# Altium schematic sheet boxer_supply.SchDoc: Power and Supply (+5V)
size A4; DrawnBy: Damian Dolewski; Engineer: Damian Dolewski; DocumentNumber: 2; SheetNumber: 2; SheetTotal: 3
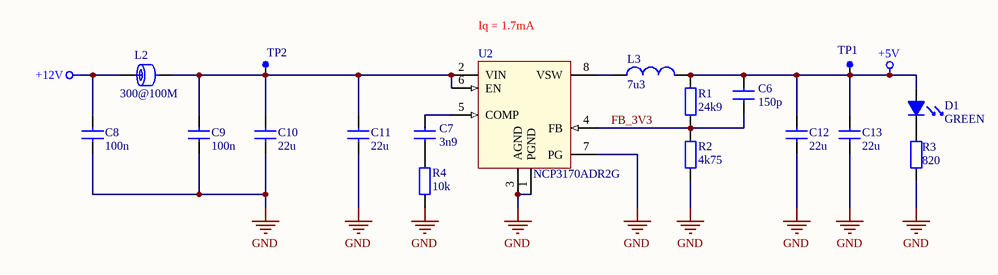
[diagram p0: boxer_supply.SchDoc]

## Parts
C6  value 150p  [C_0805]  (hidden comment: 885012207081)
C7  value 3n9  [C_0805]  (hidden comment: 885012207089)
C8  value 100n  [C_0805]  (hidden comment: Capacitor)
C9  value 100n  [C_0805]  (hidden comment: Capacitor)
C10  value 22u  [C_1206]  (hidden comment: TME: CL31A226MOCLNNC)
C11  value 22u  [C_1206]  (hidden comment: TME: CL31A226MOCLNNC)
C12  value 22u  [C_1206]  (hidden comment: TME: CL31A226MOCLNNC)
C13  value 22u  [C_1206]  (hidden comment: TME: CL31A226MOCLNNC)
D1  value GREEN  [LED_0805]  (hidden comment: KP-2012LSGC)
L2  value 300@100M  [L_0805]  (hidden comment: 742792031)
L3  value 7u3  [L_6.7x6.7mm]  (hidden comment: 308-1500-1-ND)
R1  value 24k9  [R_0805]  (hidden comment: RNCP0805FTD24K9)
R2  value 4k75  [R_0805]  (hidden comment: RNCP0805FTD4K75)
R3  value 820  [R_0805]  (hidden comment: Resistor)
R4  value 10k  [R_1206]  (hidden comment: Resistor)
TP1  TEST PAD  [PIN]  (value not drawn)
TP2  TEST PAD  [PIN]  (value not drawn)
U2  NCP3170ADR2G  [SO8]

## Nets
+5V: C6.2 C12.2 C13.2 D1.1(A) L3.2 R1.2 TP1.1
+12V: C8.2 L2.1
GND: C8.1 C9.1 C10.1 C11.1 C12.1 C13.1 R2.1 R3.1 R4.1 U2.1(PGND) U2.3(AGND) U2.7(PG)
FB_3V3: C6.1 R1.1 R2.2 U2.4(FB)
NetC7_1: C7.1 R4.2
NetC7_2: C7.2 U2.5(COMP)
NetC9_2: C9.2 C10.2 C11.2 L2.2 TP2.1 U2.2(VIN) U2.6(EN)
NetD1_2: D1.2(K) R3.2
NetL3_1: L3.1 U2.8(VSW)

## Notes on the sheet
- (near U2) Iq = 1.7mA
- Title:
- Size:
- A4
- Number:
- Revision:
- Date:
- File:
- Sheet
- of

## Library data of the parts
C6 C7 C10-C13 = Capacitor
D1 = LED: Typical RED, GREEN, YELLOW, AMBER GaAs LED
L2 = FB: Ferrite Bead
L3 = Inductor: FIXED IND 7.3UH 2.1A 54 MOHM SMD
R1 R2 = Resistor
TP1 TP2 = TEST_PAD: PAD 1.5mm
U2 = NCP3170: Synchronous PWM Switching Converter; Value: NCP3170ADR2G